# Altium schematic sheet ESP8266.SchDoc
size A4
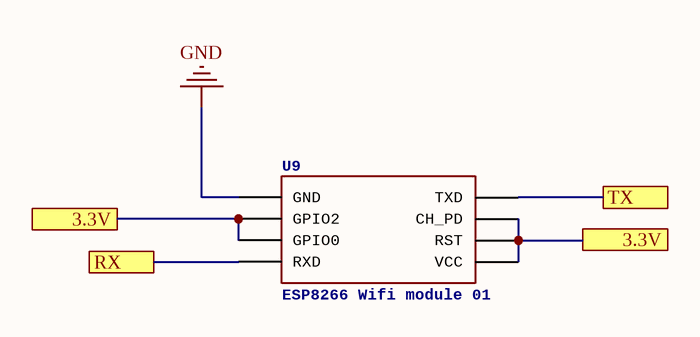
[diagram p0: ESP8266.SchDoc]

## Parts
U9  ESP8266 Wifi module 01  [ESP01]

## Ports
3.3V, RX, TX

## Nets
GND: U9.GND
3.3V: U9.CH_PD U9.GPIO0 U9.GPIO2 U9.RST U9.VCC ; port 3.3V
RX: U9.RX(RXD) ; port RX
TX: U9.TX(TXD) ; port TX

## Library data of the parts
U9 = ESP01: GateName_1: G$1; SymbolName_1: ESP01; LibraryName: esp8266modules; DeviceSetName: ESP01; Package: ESP01